# EAGLE design pentajoy_pwr (EAGLE 5.11)
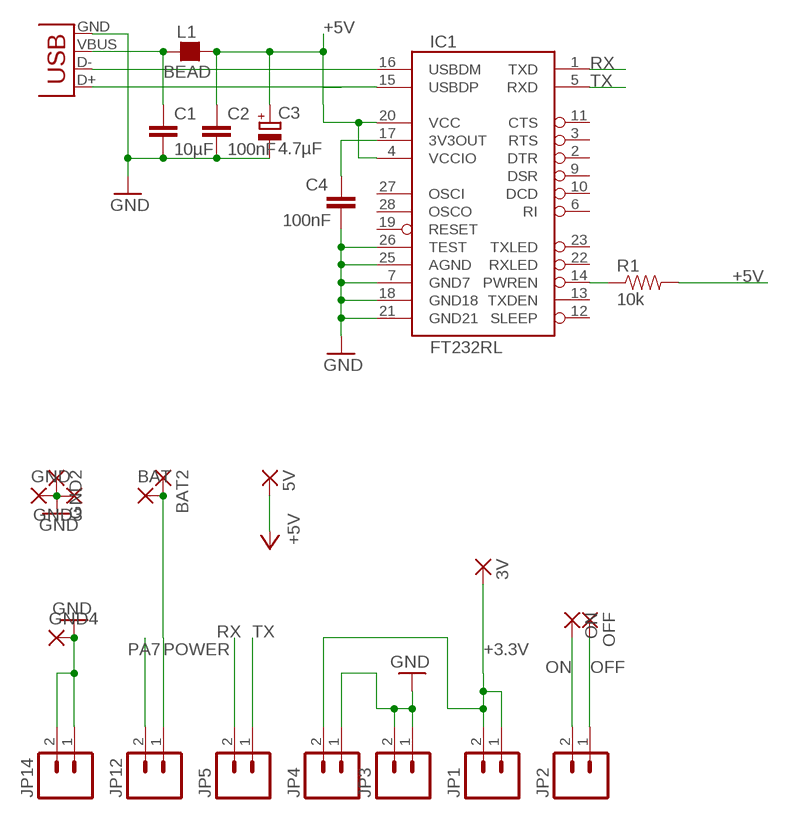
[diagram p0: schematic, sheet 1]

## Parts
3V  SMD5  [SMD2,54-5,08]
5V  SMD5  [SMD2,54-5,08]
BAT  SMD5  [SMD2,54-5,08]
BAT2  SMD5  [SMD2,54-5,08]
C1  10µF  CAP0805  [0805]
C2  100nF  CAP0805  [0805]
C3  4.7µF  CPOL-EUSMCC  [SMC_C]
C4  100nF  CAP0805  [0805]
GND  SMD5  [SMD2,54-5,08]
GND2  SMD5  [SMD2,54-5,08]
GND3  SMD5  [SMD2,54-5,08]
GND4  SMD5  [SMD2,54-5,08]
IC1  FT232RL  FT232RLSSOP  [SSOP28DB]
JP1  M02PTH  [1X02]
JP2  M02PTH  [1X02]
JP3  M02PTH  [1X02]
JP4  M02PTH  [1X02]
JP5  M02PTH  [1X02]
JP12  M02PTH  [1X02]
JP14  M02PTH  [1X02]
L1  BEAD  FB_0805  [L0805]
OFF  SMD5  [SMD2,54-5,08]
ON  SMD5  [SMD2,54-5,08]
R1  10k  RESISTOR  [0805]
X2  USB-SMD-NS  [USB-MINIB-NOSTOP]

## Nets
+3.3V: 3V.1(P) JP1.1 JP1.2 JP4.2
+5V: 5V.1(P) C2.1 C3.+ IC1.4(VCCIO) IC1.20(VCC) L1.2 R1.2
GND: C1.2 C2.2 C3.- C4.2 GND2.1(P) GND3.1(P) GND4.1(P) GND.1(P) IC1.7(GND7) IC1.18(GND18) IC1.21(GND21) IC1.25(AGND) IC1.26(TEST) JP3.1 JP3.2 JP4.1 JP14.1 JP14.2 X2.GND
N$18: IC1.16(USBDM) X2.D-
N$20: IC1.15(USBDP) X2.D+
N$23: C1.1 L1.1 X2.VBUS
N$24: IC1.14(PWREN) R1.1
N$29: C4.1 IC1.17(3V3OUT)
OFF: JP2.1 OFF.1(P)
ON: JP2.2 ON.1(P)
PA7: JP12.2
POWER: BAT2.1(P) BAT.1(P) JP12.1
RX: IC1.1(TXD) JP5.2
TX: IC1.5(RXD) JP5.1
Unconnected: IC1.2(DTR) IC1.3(RTS) IC1.6(RI) IC1.9(DSR) IC1.10(DCD) IC1.11(CTS) IC1.12(SLEEP) IC1.13(TXDEN) IC1.19(RESET) IC1.22(RXLED) IC1.23(TXLED) IC1.27(OSCI) IC1.28(OSCO)

## Library data of the parts
3V 5V BAT BAT2 GND GND2-GND4 OFF ON = wirepad:SMD5: SMD PAD
C1 C2 C4 = SparkFun:CAP: Capacitor Standard 0603 ceramic capacitor, and 0.1" leaded capacitor.
C3 = resistor:CPOL-EU: POLARIZED CAPACITOR, European symbol
IC1 = SparkFun:FT232RL: USB UART FT232RL 4th Generation USB UART (USB <-> Serial) Controller. Spark Fun Electronics SKU : COM-00650
JP1-JP5 JP12 JP14 = SparkFun:M02: Header 2 Standard 2-pin 0.1" header. Use with straight break away headers (SKU : PRT-00116), right angle break away headers (PRT-00553), swiss pins (PRT-00743), machine pins (PRT-00117), and female headers (PRT-00115). Molex polarized connector foot print use with SKU : PRT-08233 with associated crimp pins and housings.
L1 = rc-master-smd:FB_: FERRITE BEAD
R1 = SparkFun:RESISTOR: Resistor Basic schematic elements and footprints for 0603, 1206, and PTH 1/10th watt (small) resistors.
X2 = SparkFun:USB: USB Connectors USB-B-PTH is fully proven SKU : PRT-00139 USB-miniB is fully proven SKU : PRT-00587 USB-A-PCB is untested. USB-A-H is throughly reviewed, but untested. Spark Fun Electronics SKU : PRT-00437 USB-B-SMT is throughly reviewed, but untested. Needs silkscreen touching up. USB-A-S has not been used/tested USB-MB-H has not been used/tested

## Board
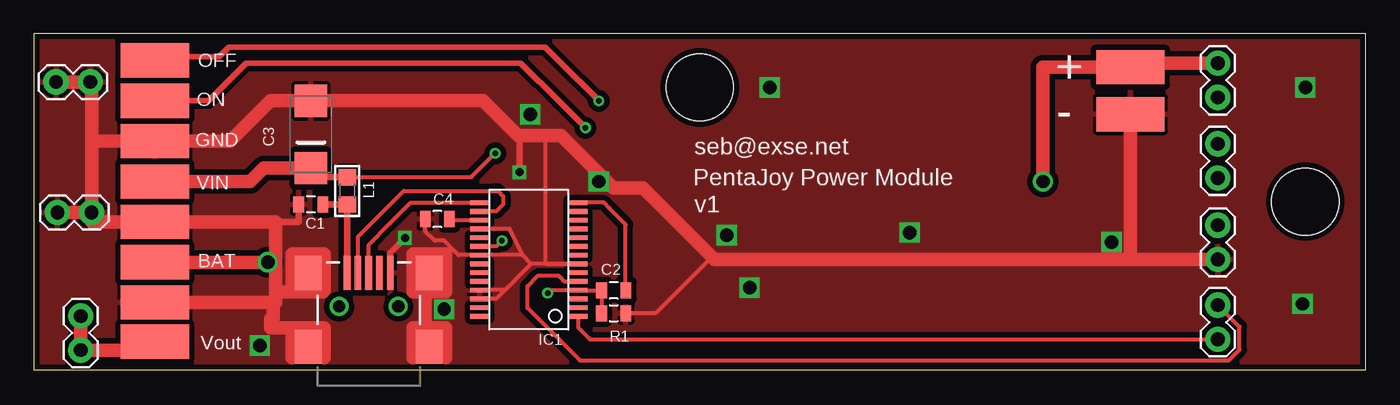
[diagram p1: board, top side]
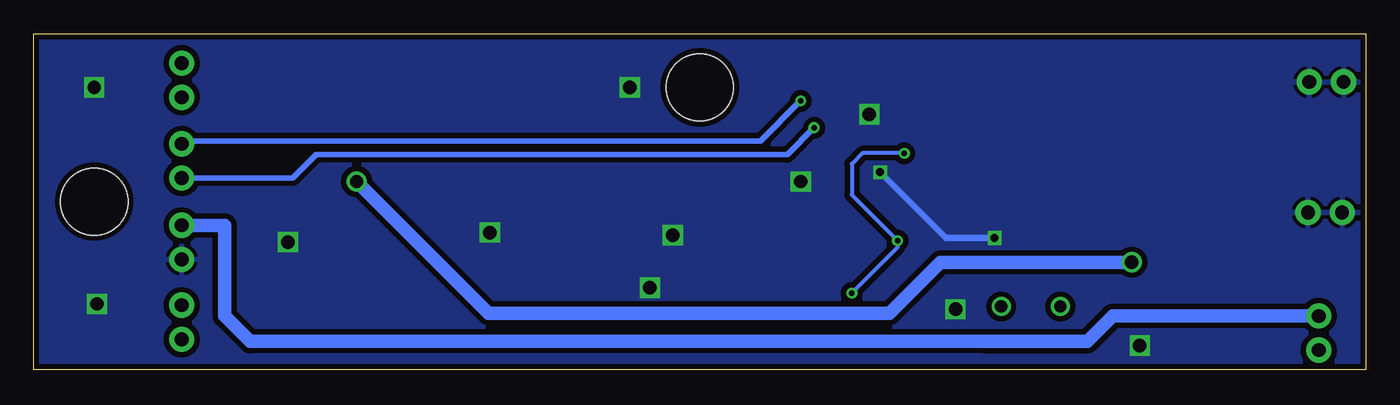
[diagram p2: board, bottom side, seen from below]

Size 99 x 25 mm. Coordinates in mm from the lower left corner, seen from the top.
Outline: 99,25 0,25 0,0 99,0 99,25
Copper layers (1+2*3+16): Top 0.035mm / dielectric 1.5mm / Route2 0.035mm / dielectric 0.15mm / Route3 0.035mm / dielectric 0.2mm / Bottom 0.035mm
Design rules "default *": minimum track width 10mil, minimum drill 0.4mm, track to track 8mil, track to pad 8mil, pad to pad 8mil, via to via 8mil, smd to smd 8mil, copper to edge 15mil, drill to drill 8mil, minimum pad ring 10mil, minimum via ring 8mil, stop-mask expansion 4mil, vias tented up to drill 190mil, thermal gap 10mil
Holes 5 mm at 94.5,12.5 49.5,21

### Footprints (pad centres in the part's own frame; a part is rotated, then mirrored left to right if it is on the bottom)
SMD2,54-5,08 = smd 2.54 x 5.08: 1 0,0
0805 = smd 0.8 x 1.2: 1 -0.9,0; 2 0.9,0
SMC_C = smd 2.4 x 2.4: + -2.5,0; - 2.5,0
SSOP28DB = smd 0.348 x 1.397: 1 -4.225,-3.656; 2 -3.575,-3.656; 3 -2.925,-3.656; 4 -2.275,-3.656; 5 -1.625,-3.656; 6 -0.975,-3.656; 7 -0.325,-3.656; 8 0.325,-3.656; 9 0.975,-3.656; 10 1.625,-3.656; 11 2.275,-3.656; 12 2.925,-3.656; 13 3.575,-3.656; 14 4.225,-3.656; 15 4.225,3.656; 16 3.575,3.656; 17 2.925,3.656; 18 2.275,3.656; 19 1.625,3.656; 20 0.975,3.656; 21 0.325,3.656; 22 -0.325,3.656; 23 -0.975,3.656; 24 -1.625,3.656; 25 -2.275,3.656; 26 -2.925,3.656; 27 -3.575,3.656; 28 -4.225,3.656
1X02 = drill 1.016 pad 1.88 round: 1 0,0; 2 2.54,0
L0805 = smd 1.2 x 1.3: 1 -1.016,0; 2 1.016,0
USB-MINIB-NOSTOP = smd 2.5 x 0.5: D+ 2.5,0; D- 2.5,0.8; GND 2.5,-1.6; ID 2.5,-0.8; VBUS 2.5,1.6 | smd 2.5 x 2: G1 -3,-4.5; G2 -3,4.5; G3 2.5,4.5; G4 2.5,-4.5 | drill 0.9 pad 0.8 round: H1 0,2.2 | drill 0.9 pad 0.787 round: H2 0,-2.2

### Placement (x,y rotation side)
3V  9,2.1 270 top
5V  9,14 90 top
BAT  9,8 90 top
BAT2  81.5,22.5 90 top
C1  20.6,12.3 180 top
C2  43.1,4.2 0 top
C3  20.6,17.5 90 top
C4  30,11.2 180 top
GND  9,5 90 top
GND2  81.5,19 90 top
GND3  9,11 90 top
GND4  9,17 90 top
IC1  36.8,8.2 90 top
JP1  3.5,4 270 top
JP2  88,16.8 270 top
JP3  4.3,11.7 180 top
JP4  88,8.2 90 top
JP5  88,4.8 270 top
JP12  88,22.8 270 top
JP14  4.2,21.4 180 top
L1  23.3,13.3 90 top
OFF  9,23 90 top
ON  9,20 90 top
R1  43.1,5.9 180 top
X2  24.9,4.7 90 top

### Tracks (layer width: path | path; a pad name or v marks a point on that pad's centre or on a via)
+3.3V
  Top 1.016: JP1.1 JP1.2 9,1.46 3V.1
  Bottom 1: 28.3,2.1 82.9,2.1 84.8,4
  Bottom 1.016: JP4.2 84.8,10.74 84.8,6.2 84.8,4 | JP1.1 18.8,4 20.7,2.1 28.3,2.1
+5V  (via drill 0.4)
  Top 0.305: IC1.20 34.38,9.18 v34.8,9.6 | v38.2,5.7 38.42,5.92 IC1.4 40.48,5.9 R1.2 C2.1 | L1.2 32.52,14.32 v34.3,16.1
  Top 0.5: L1.2 20.6,14.32 C3.+
  Top 1.016: 5V.1 16.1,14 16.7,14.6 17.1,15 C3.+
  Bottom 0.305: v38.2,5.7 34.8,9.1 v34.8,9.6 38.2,13 38.2,15.3 37.4,16.1 v34.3,16.1
GND  (via drill 0.6, 1)
  Top 0.305: IC1.25 35.02,5.92 35.65,6.55 | 35.65,6.55 35.9,6.8 36.98,7.88 | 37.6,7.88 IC1.7 38.02,7.88 38,7.9 38,17 38.4,17.4 | 37.6,7.88 37.5,7.88 | 37.5,7.88 36.98,7.88 | 36.33,8.53 IC1.21 31.57,8.53 31.3,8.8 30.5,9.6 29.8,9.6 29.1,10.3 C4.2 | 36.98,7.88 36.33,8.53 | IC1.26 34.38,5.28 35.65,6.55 | IC1.18 35.38,10.47 36.33,8.53 | 37.6,7.88 37.5,7.88 | C2.2 46.2,4.2 50.4,8.4
  Top 0.5: C1.2 19.7,11 17.7,11 | X2.GND 26.5,8.7 v27.6,9.8 | v36.1,14.7 36.1,17.3 36,17.4
  Top 1.016: 81.5,8.2 JP4.1 | JP3.1 JP3.2 | JP14.2 JP14.1 4.3,21.4 4.3,17 | JP3.1 4.3,17 | 81.5,8.2 81.5,11 GND2.1 | JP3.1 4.3,11 GND3.1 15.8,11 17.7,11 18,11 18,5.3 | 4.3,17 GND4.1 14.6,17 17.6,20 C3.- 33.4,20 36,17.4 38.4,17.4 39.2,17.4 43.1,13.5 45.3,13.5 50.4,8.4 50.6,8.2 81.5,8.2 | 17.8,5 18,5 18,5.3 | GND.1 17.8,5 | 29.1,5.8 30.6,5.8 30.6,8.6 28.2,8.6 28.2,5.8 29.1,5.8 | 21.6,5.9 21.6,8.6 19.2,8.6 19.2,5.8 | 19.2,5.8 21.5,5.8 21.5,5.9 | 21.6,0.9 21.6,3.1 19.2,3.1 | 19.2,3.1 19.2,0.9 | 30.6,0.9 30.6,3.1 28.2,3.1 | 28.2,0.9 28.2,3.1 | 28.2,3.1 29.1,3.1 29.1,4.4 29.1,5.8 | 19.2,3.1 17.6,3.1 17.6,3.8 17.8,3.8 17.8,5 | 19.2,5.8 18,5.8 18,5.3
  Bottom 0.5: v27.6,9.8 31.2,9.8 v36.1,14.7
  other vias: 94.3,4.9 94.5,21 80.1,9.5 65.1,10.2 54.7,21 51.5,10 53.2,6.1 42,14 36.9,19 30.5,4.5 16.8,1.8
  pour Bottom (isolate 0.4): 0,25.2 99,25.2 99,0 0,0
  pour Top (isolate 0.4): 0,25.2 99,25.2 99,0 0,0
N$18
  Top 0.305: X2.D- 24.1,9.9 26.2,12 27.5,13.3 34.3,13.3 34.5,13.3 34.9,12.9 34.9,12.3 34.6,12 34.38,11.78 IC1.16
N$20
  Top 0.305: X2.D+ 24.9,9.3 26.5,10.9 28.02,12.43 IC1.15
N$23
  Top 0.5: X2.VBUS L1.1 21.5,12.28 C1.1
N$24
  Top 0.305: R1.1 44,10.8 42.8,12 42.38,12.43 IC1.14
N$29
  Top 0.305: IC1.17 30.98,11.12 C4.1
OFF  (via drill 0.4)
  Top 0.406: v42,20 39,23 38,24 14.5,24 13.8,23.3 13.4,23.3 9.3,23.3 OFF.1
  Bottom 0.406: JP2.1 87.8,17 45,17 v42,20
ON  (via drill 0.4)
  Top 0.406: v41,18 39,20 36.2,22.8 21.4,22.8 15.8,22.8 13.5,20.5 13,20 ON.1
  Bottom 0.406: JP2.2 79.74,14.26 78,16 43,16 v41,18
POWER  (via drill 1)
  Top 1.016: JP12.1 81.5,22.8 BAT2.1 75,22.5 v75,14 | BAT.1 v17.4,8
  Bottom 1: v75,14 70.7,9.7 65.2,4.2 35.4,4.2 31.6,8 17.5,8
  Bottom 1.016: v17.4,8 17.5,8
RX
  Top 0.305: JP5.2 41.34,2.26 40.7,2.9 40.46,3.14 IC1.1
TX
  Top 0.305: JP5.1 89.6,3.2 89.6,1.5 88.8,0.7 87.2,0.7 40.6,0.7 36.7,4.6 36.7,6.2 37.5,7 39,7 39.1,6.9 39.42,6.58 IC1.5

### Text on the board
tPlace: OFF | + | ON | - | GND | seb@exse.net | PentaJoy Power Module | VIN | v1 | BAT | Vout
bStop: PentaJoy